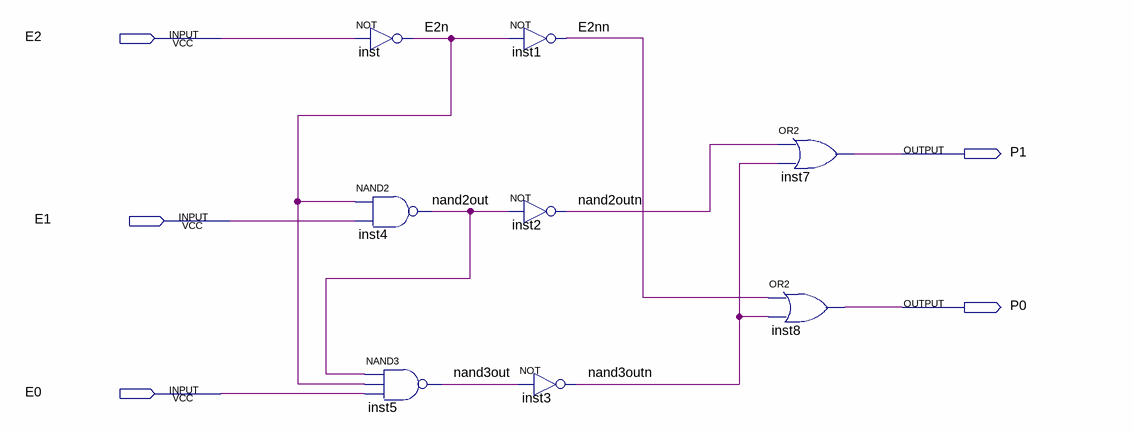
[diagram p0: schematic sheet]
// Quartus schematic Encoder.bdf as structural Verilog: 8 symbols, 5 pins
module Encoder (
  input  E2,
  input  E1,
  input  E0,
  output P1,
  output P0
);

  wire E2n, E2nn, nand2out, nand2outn, nand3out, nand3outn;

  not inst (E2n, E2);
  nand inst4 (nand2out, E2n, E1);
  nand inst5 (nand3out, nand2out, E2n, E0);
  not inst1 (E2nn, E2n);
  not inst2 (nand2outn, nand2out);
  not inst3 (nand3outn, nand3out);
  or inst7 (P1, nand2outn, nand3outn);
  or inst8 (P0, E2nn, nand3outn);
endmodule
